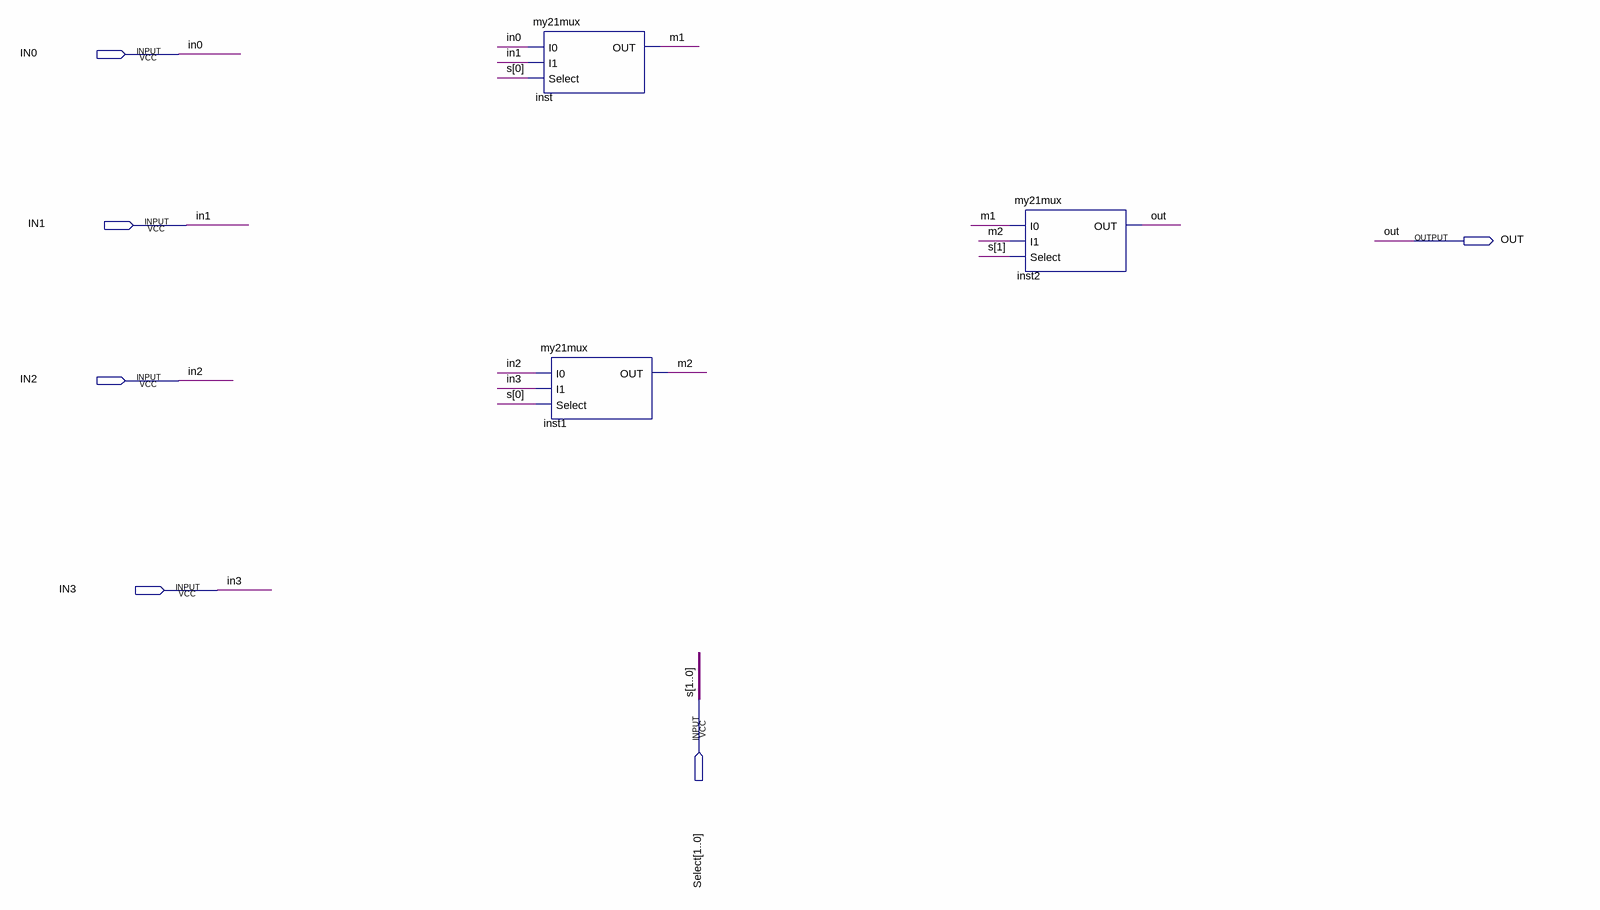
[diagram p0: schematic sheet]
// Quartus schematic mymux4_1.bdf as structural Verilog: 3 symbols, 6 pins
module mymux4_1 (
  input  IN0,
  input  IN1,
  input  IN2,
  input  IN3,
  input  [1:0] Select,
  output OUT
);

  wire m1, m2;

  my21mux inst (.I0(IN0), .I1(IN1), .Select(Select[0]), .OUT(m1));
  my21mux inst1 (.I0(IN2), .I1(IN3), .Select(Select[0]), .OUT(m2));
  my21mux inst2 (.I0(m1), .I1(m2), .Select(Select[1]), .OUT(OUT));

  // Other names for the same wires on the sheet: s[1:0] = Select
endmodule
